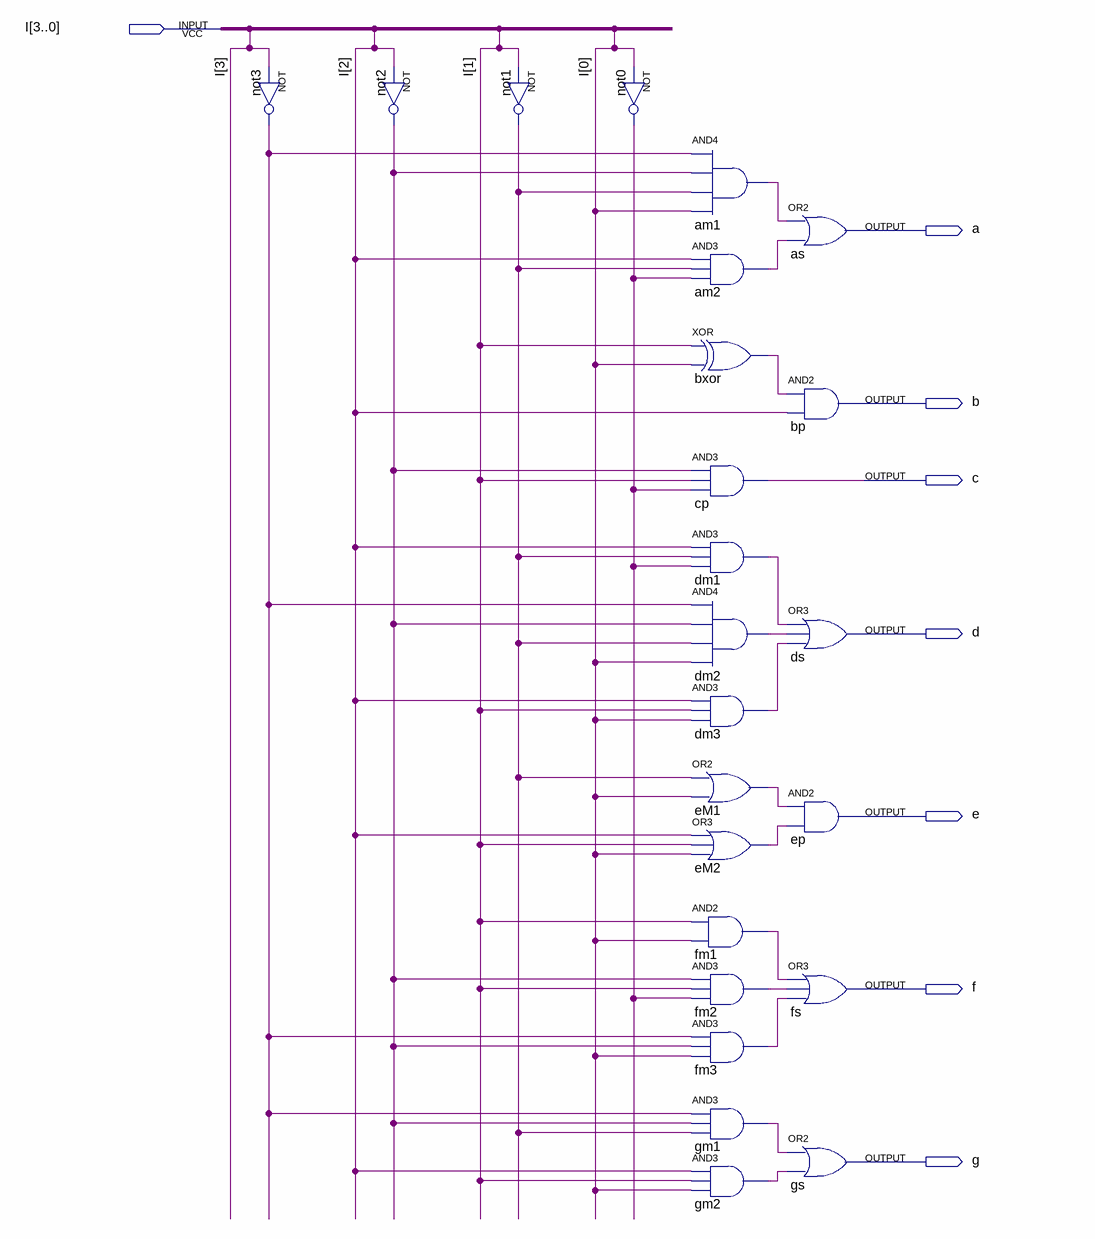
[diagram p0: schematic sheet]
// Quartus schematic U0-9.bdf as structural Verilog: 24 symbols, 8 pins
module \U0-9  (
  input  [3:0] I,
  output a,
  output b,
  output c,
  output d,
  output e,
  output f,
  output g
);

  wire am1_out, am2_out, bxor_out, dm1_out, dm2_out, dm3_out, eM1_out, eM2_out, fm1_out, fm2_out, fm3_out,
       gm1_out, gm2_out, not0_out, not1_out, not2_out, not3_out;

  not not3 (not3_out, I[3]);
  not not2 (not2_out, I[2]);
  not not1 (not1_out, I[1]);
  not not0 (not0_out, I[0]);
  and am1 (am1_out, not3_out, not2_out, not1_out, I[0]);
  and am2 (am2_out, I[2], not1_out, not0_out);
  xor bxor (bxor_out, I[1], I[0]);
  and cp (c, not2_out, I[1], not0_out);
  and dm1 (dm1_out, I[2], not1_out, not0_out);
  and dm2 (dm2_out, not3_out, not2_out, not1_out, I[0]);
  and dm3 (dm3_out, I[2], I[1], I[0]);
  or eM1 (eM1_out, not1_out, I[0]);
  or eM2 (eM2_out, I[2], I[1], I[0]);
  and fm1 (fm1_out, I[1], I[0]);
  and fm2 (fm2_out, not2_out, I[1], not0_out);
  and fm3 (fm3_out, not3_out, not2_out, I[0]);
  and gm1 (gm1_out, not3_out, not2_out, not1_out);
  and gm2 (gm2_out, I[2], I[1], I[0]);
  or as (a, am1_out, am2_out);
  and bp (b, bxor_out, I[2]);
  or ds (d, dm1_out, dm2_out, dm3_out);
  and ep (e, eM1_out, eM2_out);
  or fs (f, fm1_out, fm2_out, fm3_out);
  or gs (g, gm1_out, gm2_out);
endmodule
